# Altium schematic sheet Sheet1.SchDoc
size A4
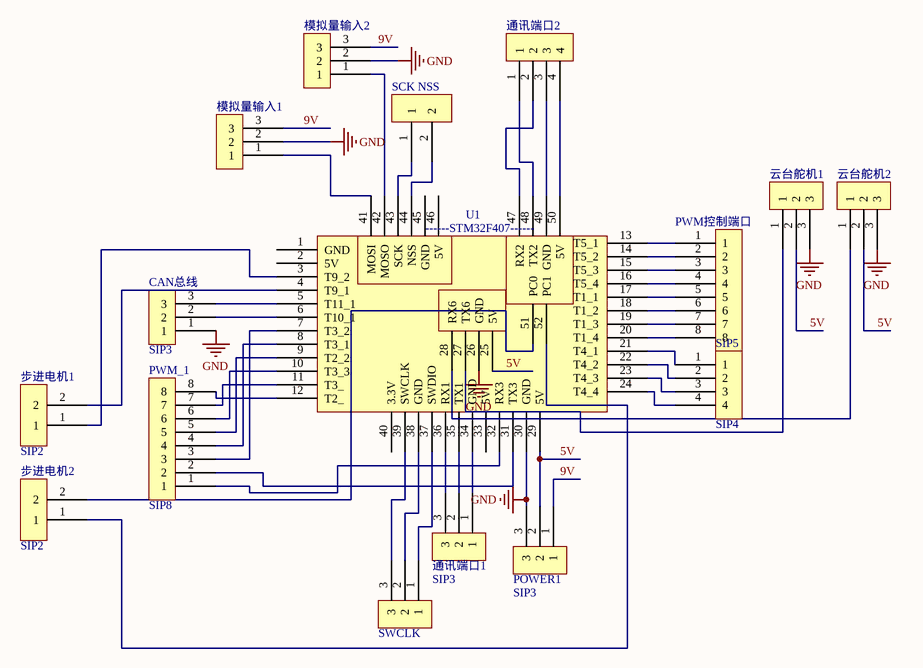
[diagram p0: Sheet1.SchDoc]

## Parts
CAN总线  SIP3  [SIP3]
POWER1  SIP3  [SIP3]
PWM_1  SIP8  [SIP8]
PWM控制端口  PWM控制端口  [SIP8]  (value not drawn)
SCK_NSS  SIP2  [SIP2]  (value not drawn)
SIP5  SIP4  [SIP4]
SWCLK  SIP3  [SIP3]  (value not drawn)
U1  ------STM32F407------  [-----STM32F407-----]
云台舵机1  SIP3  [SIP3]  (value not drawn)
云台舵机2  SIP3  [SIP3]  (value not drawn)
模拟量输入1  SIP3  [SIP3]  (value not drawn)
模拟量输入2  SIP3  [SIP3]  (value not drawn)
步进电机1  SIP2  [SIP2-3MM]
步进电机2  SIP2  [SIP2-3MM]
通讯端口1  SIP3  [SIP3]
通讯端口2  SIP4  [SIP4]  (value not drawn)

## Nets
GND: CAN总线.1 POWER1.3 U1.26(GND) U1.30(GND) 云台舵机1.3 云台舵机2.3 模拟量输入1.2 模拟量输入2.2
5V: POWER1.2 U1.25(5V) U1.29(5V) 云台舵机1.2 云台舵机2.2
9V: POWER1.1 模拟量输入1.3 模拟量输入2.3
NetCAN总线_2: CAN总线.2 U1.6(T10_1)
NetCAN总线_3: CAN总线.3 U1.5(T11_1)
NetPWM_1_1: PWM_1.1 U1.32(RX3)
NetPWM_1_2: PWM_1.2 U1.31(TX3)
NetPWM_1_3: PWM_1.3 U1.7(T3_2)
NetPWM_1_4: PWM_1.4 U1.8(T3_1)
NetPWM_1_5: PWM_1.5 U1.9(T2_2)
NetPWM_1_6: PWM_1.6 U1.10(T3_3)
NetPWM_1_7: PWM_1.7 U1.11(T3_)
NetPWM_1_8: PWM_1.8 U1.12(T2_)
NetPWM控制端口_1: PWM控制端口.1 U1.13(T5_1)
NetPWM控制端口_2: PWM控制端口.2 U1.14(T5_2)
NetPWM控制端口_3: PWM控制端口.3 U1.15(T5_3)
NetPWM控制端口_4: PWM控制端口.4 U1.16(T5_4)
NetPWM控制端口_5: PWM控制端口.5 U1.17(T1_1)
NetPWM控制端口_6: PWM控制端口.6 U1.18(T1_2)
NetPWM控制端口_7: PWM控制端口.7 U1.19(T1_3)
NetPWM控制端口_8: PWM控制端口.8 U1.20(T1_4)
NetSCK_NSS_1: SCK_NSS.1 U1.43(SCK)
NetSCK_NSS_2: SCK_NSS.2 U1.44(NSS)
NetSIP5_1: SIP5.1 U1.21(T4_1)
NetSIP5_2: SIP5.2 U1.22(T4_2)
NetSIP5_3: SIP5.3 U1.23(T4_3)
NetSIP5_4: SIP5.4 U1.24(T4_4)
NetSWCLK_1: SWCLK.1 U1.37(SWDIO)
NetSWCLK_2: SWCLK.2 U1.38(GND)
NetSWCLK_3: SWCLK.3 U1.39(SWCLK)
NetU1_3: U1.3(T9_2) 步进电机1.1
NetU1_4: U1.4(T9_1) 步进电机1.2
NetU1_27: U1.27(TX6) 云台舵机1.1
NetU1_28: U1.28(RX6) 云台舵机2.1
NetU1_34: U1.34(GND) 通讯端口1.1
NetU1_35: U1.35(TX1) 通讯端口1.2
NetU1_36: U1.36(RX1) 通讯端口1.3
NetU1_41: U1.41(MOSI) 模拟量输入1.1
NetU1_42: U1.42(MOSO) 模拟量输入2.1
NetU1_47: U1.47(RX2) 通讯端口2.2
NetU1_48: U1.48(TX2) 通讯端口2.1
NetU1_49: U1.49(GND) 通讯端口2.3
NetU1_50: U1.50(5V) 通讯端口2.4
NetU1_51: U1.51(PC0) 步进电机2.2
NetU1_52: U1.52(PC1) 步进电机2.1

Not connected (* = marked no-connect by the designer): U1 1(GND) 2(5V) 33(5V) 40(3.3V) 45(GND) 46(5V)

## Library data of the parts
PWM控制端口 = SIP8